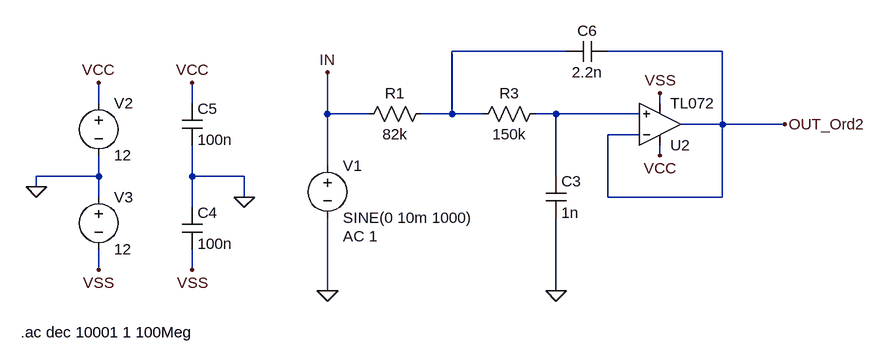
[diagram p0: schematic SK_ordnung2_1kHz_3dB_0dB_butter.asc]
SK_ordnung2_1kHz_3dB_0dB_butter.asc, the LTspice schematic file:
Version 4
SHEET 1 1316 736
WIRE 112 112 -64 112
WIRE 352 112 176 112
WIRE -608 192 -608 160
WIRE -464 192 -464 160
WIRE 256 192 256 176
WIRE -256 208 -256 144
WIRE -192 208 -256 208
WIRE -64 208 -64 112
WIRE -64 208 -112 208
WIRE -16 208 -64 208
WIRE 96 208 64 208
WIRE 224 208 96 208
WIRE 352 224 352 112
WIRE 352 224 288 224
WIRE 448 224 352 224
WIRE 224 240 176 240
WIRE 256 272 256 256
WIRE -256 288 -256 208
WIRE -608 304 -608 272
WIRE -608 304 -704 304
WIRE -464 304 -464 256
WIRE -384 304 -464 304
WIRE 96 304 96 208
WIRE -704 320 -704 304
WIRE -608 336 -608 304
WIRE -384 336 -384 304
WIRE 176 336 176 240
WIRE 352 336 352 224
WIRE 352 336 176 336
WIRE -464 352 -464 304
WIRE -608 448 -608 416
WIRE -464 448 -464 416
WIRE -256 480 -256 368
WIRE 96 480 96 368
FLAG -608 160 VCC
FLAG -608 448 VSS
FLAG -704 320 0
FLAG -464 160 VCC
FLAG -464 448 VSS
FLAG -384 336 0
FLAG -256 480 0
FLAG -256 144 IN
FLAG 96 480 0
FLAG 256 176 VSS
FLAG 256 272 VCC
FLAG 448 224 OUT_Ord2
SYMBOL voltage -256 272 R0
WINDOW 123 24 124 Left 2
WINDOW 39 0 0 Left 0
SYMATTR Value2 AC 1
SYMATTR InstName V1
SYMATTR Value SINE(0 10m 1000)
SYMBOL voltage -608 176 R0
WINDOW 123 0 0 Left 0
WINDOW 39 0 0 Left 0
SYMATTR InstName V2
SYMATTR Value 12
SYMBOL voltage -608 320 R0
WINDOW 123 0 0 Left 0
WINDOW 39 0 0 Left 0
SYMATTR InstName V3
SYMATTR Value 12
SYMBOL cap -480 192 R0
SYMATTR InstName C5
SYMATTR Value 100n
SYMBOL cap -480 352 R0
SYMATTR InstName C4
SYMATTR Value 100n
SYMBOL res 80 192 R90
WINDOW 0 0 56 VBottom 2
WINDOW 3 32 56 VTop 2
SYMATTR InstName R3
SYMATTR Value 150k
SYMBOL cap 80 304 R0
SYMATTR InstName C3
SYMATTR Value 1n
SYMBOL cap 176 96 R90
WINDOW 0 0 32 VBottom 2
WINDOW 3 32 32 VTop 2
SYMATTR InstName C6
SYMATTR Value 2.2n
SYMBOL TL072 256 288 M180
SYMATTR InstName U2
SYMBOL res -96 192 R90
WINDOW 0 0 56 VBottom 2
WINDOW 3 32 56 VTop 2
SYMATTR InstName R1
SYMATTR Value 82k
TEXT -728 544 Left 2 !.ac dec 10001 1 100Meg

The netlist it stands for:
* SK_ordnung2_1kHz_3dB_0dB_butter.asc
V1 IN 0 SINE(0 10m 1000) AC 1
V2 VCC 0 12
V3 0 VSS 12
C5 VCC 0 100n
C4 0 VSS 100n
R3 N002 N001 150k
C3 N002 0 1n
C6 OUT_Ord2 N001 2.2n
* U2: TL072 (symbol TL072 not available, pins judged from their places): In+=N002 In-=OUT_Ord2 V+=VCC V-=VSS OUT=OUT_Ord2
R1 N001 IN 82k
.ac dec 10001 1 100Meg
.backanno
.end